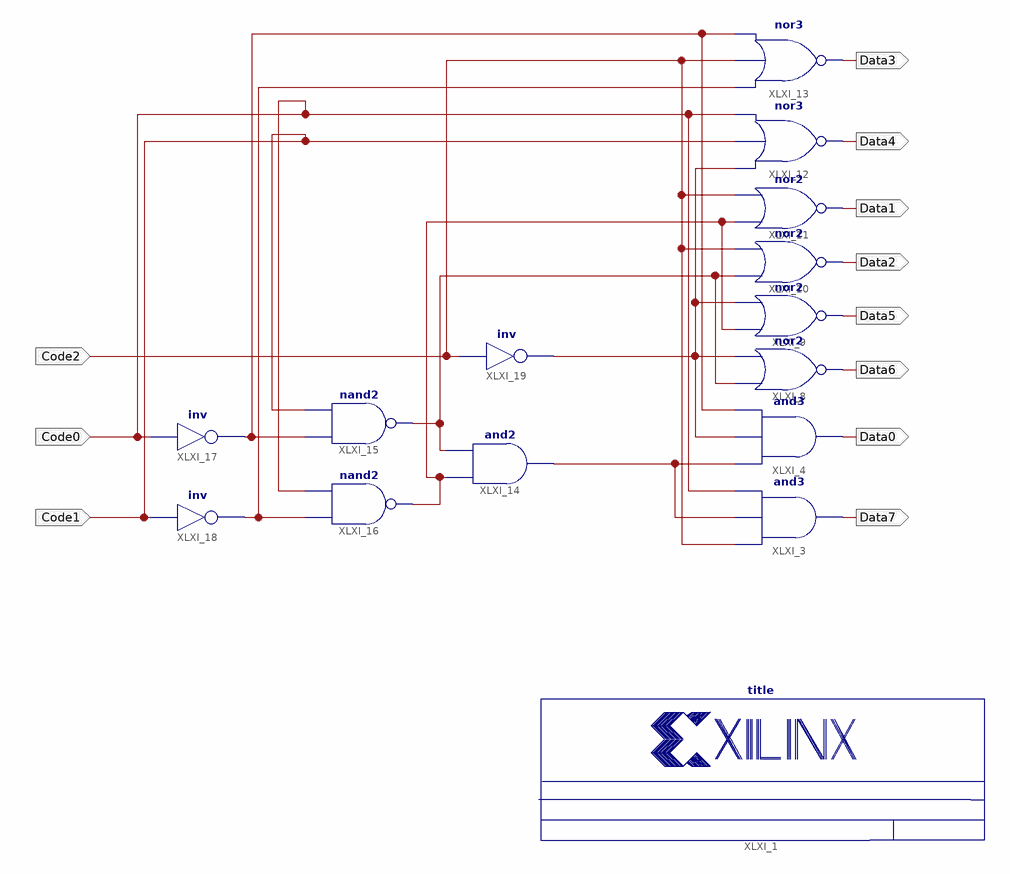
[diagram p0: schematic sheet 1]
// Xilinx ISE schematic fig_5_13.sch (spartan3e) as structural Verilog: 15 symbols, 11 ports
module fig_5_13 (
  input  Code2,
  input  Code0,
  input  Code1,
  output Data3,
  output Data4,
  output Data1,
  output Data2,
  output Data5,
  output Data6,
  output Data0,
  output Data7
);

  wire XLXN_14, XLXN_19, XLXN_24, XLXN_30, XLXN_31, XLXN_32;

  title #(.TitleFieldText("Synthesized Decoder 3:8"), .NameFieldText("Figure 5.13")) XLXI_1 ();
  and XLXI_3 (Data7, Code2, XLXN_19, Code0);
  and XLXI_4 (Data0, XLXN_19, XLXN_24, XLXN_31);
  nor XLXI_8 (Data6, XLXN_14, XLXN_24);
  nor XLXI_9 (Data5, XLXN_30, XLXN_24);
  nor XLXI_10 (Data2, XLXN_14, Code2);
  nor XLXI_11 (Data1, XLXN_30, Code2);
  nor XLXI_12 (Data4, XLXN_24, Code1, Code0);
  nor XLXI_13 (Data3, XLXN_32, Code2, XLXN_31);
  and XLXI_14 (XLXN_19, XLXN_30, XLXN_14);
  nand XLXI_15 (XLXN_14, XLXN_31, Code1);
  nand XLXI_16 (XLXN_30, XLXN_32, Code0);
  not XLXI_17 (XLXN_31, Code0);
  not XLXI_18 (XLXN_32, Code1);
  not XLXI_19 (XLXN_24, Code2);
endmodule
